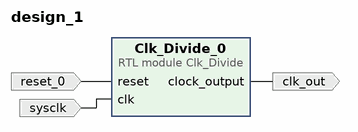
[diagram p0: block diagram of the top level]
# Vivado block design design_1, xc7z020clg400-1, Vivado 2021.1
create_bd_design design_1

create_bd_port -dir I -type clk sysclk
set_property -dict {CONFIG.FREQ_HZ 125000000} [get_bd_ports sysclk]
create_bd_port -dir O -type clk clk_out
set_property -dict {CONFIG.FREQ_HZ 1} [get_bd_ports clk_out]
create_bd_port -dir I -type rst reset_0
set_property -dict {CONFIG.POLARITY ACTIVE_HIGH} [get_bd_ports reset_0]

create_bd_cell -type module -reference Clk_Divide Clk_Divide_0
set_property -dict {CONFIG.divider 62500000} [get_bd_cells Clk_Divide_0]

# ---- connections ----

connect_bd_net [get_bd_pins Clk_Divide_0/clock_output] [get_bd_ports clk_out]
connect_bd_net -net reset_0_1 [get_bd_ports reset_0] [get_bd_pins Clk_Divide_0/reset]
connect_bd_net [get_bd_ports sysclk] [get_bd_pins Clk_Divide_0/clk]

validate_bd_design
save_bd_design
